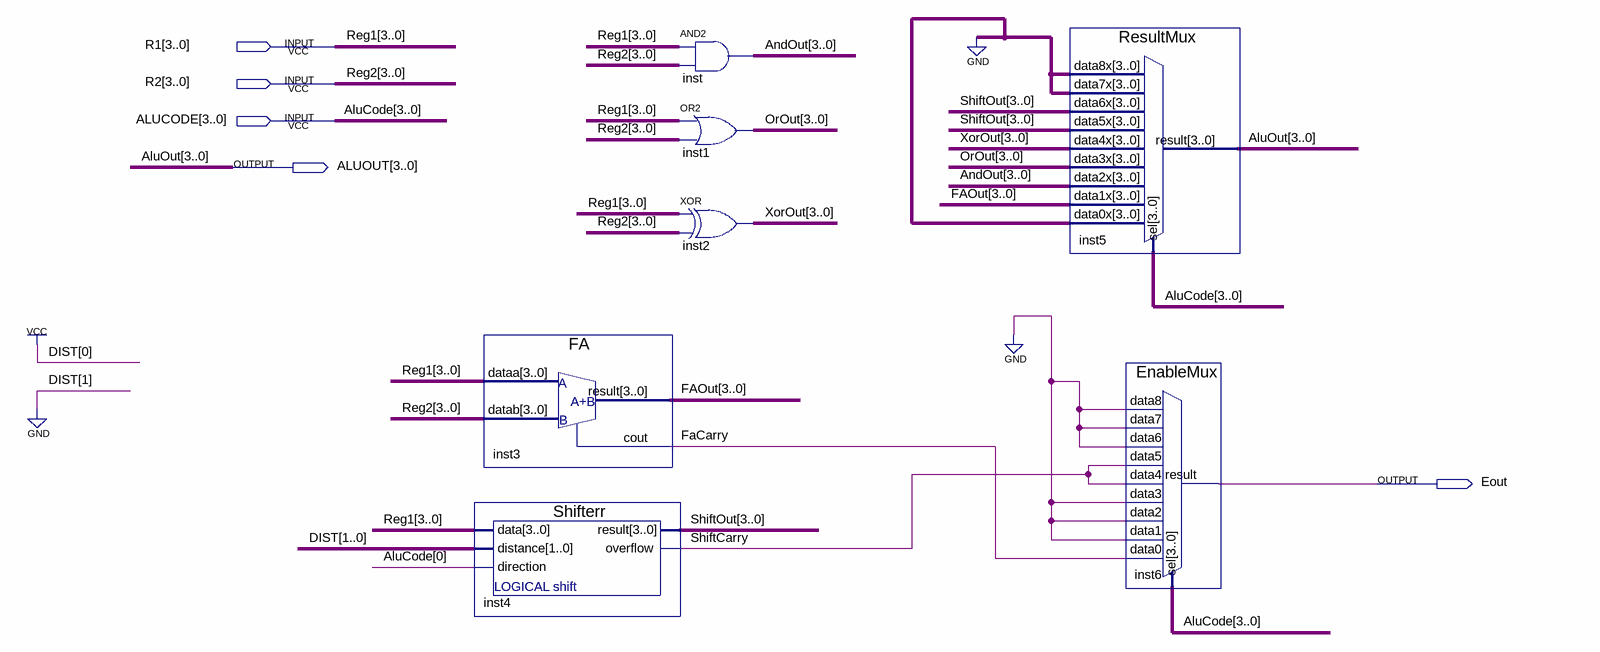
[diagram p0: schematic sheet]
// Quartus schematic Block2.bdf as structural Verilog: 7 symbols, 5 pins
module Block2 (
  input  [3:0] R1,
  input  [3:0] R2,
  input  [3:0] ALUCODE,
  output [3:0] ALUOUT,
  output Eout
);

  wire FaCarry, ShiftCarry;
  wire [3:0] AndOut, FAOut, OrOut, ShiftOut, XorOut;

  Shifterr inst4 (.data(R1), .distance(2'b01), .direction(ALUCODE[0]), .result(ShiftOut), .overflow(ShiftCarry));
  FA inst3 (.dataa(R1), .datab(R2), .result(FAOut), .cout(FaCarry));
  assign AndOut = R1 & R2;  // AND2 inst, 4 bits wide
  assign OrOut = R1 | R2;  // OR2 inst1, 4 bits wide
  assign XorOut = R1 ^ R2;  // XOR inst2, 4 bits wide
  ResultMux inst5 (
    .data8x(4'b0000), .data7x(4'b0000), .data6x(ShiftOut), .data5x(ShiftOut), .data4x(XorOut),
    .data3x(OrOut), .data2x(AndOut), .data1x(FAOut), .data0x(4'b0000), .sel(ALUCODE), .result(ALUOUT));
  EnableMux inst6 (
    .data8(1'b0), .data7(1'b0), .data6(1'b0), .data5(ShiftCarry), .data4(ShiftCarry), .data3(1'b0),
    .data2(1'b0), .data1(1'b0), .data0(FaCarry), .sel(ALUCODE), .result(Eout));

  // Other names for the same wires on the sheet: Reg1[3:0] = R1; Reg2[3:0] = R2
endmodule
